# EAGLE design line_sensor_t (EAGLE 7.2.0)
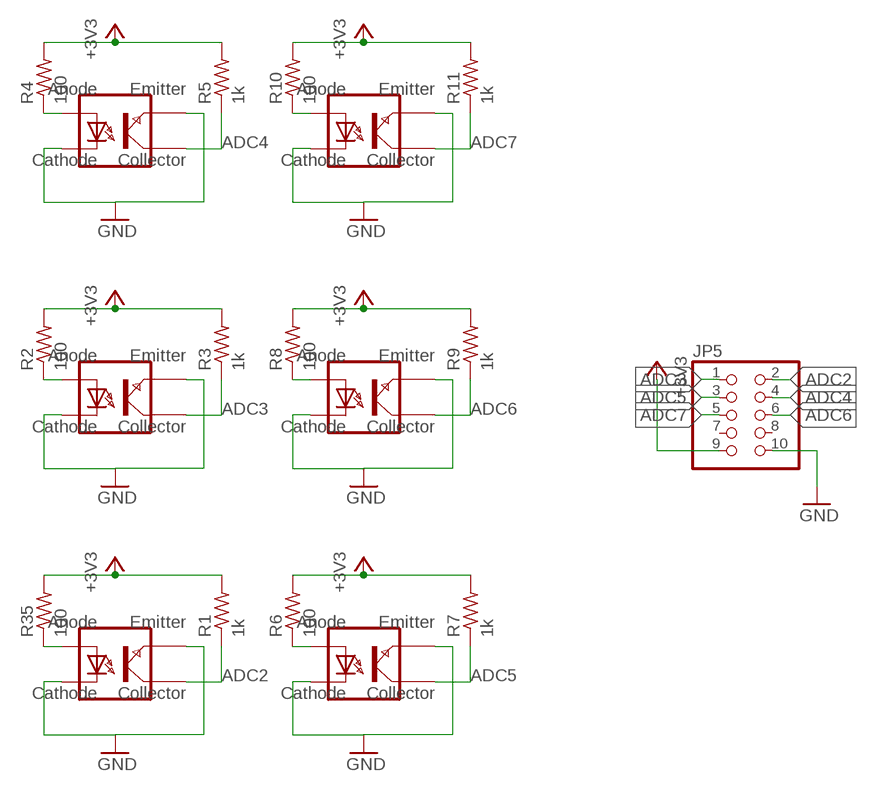
[diagram p0: schematic, sheet 1]

## Parts
JP5  PINHD-2X5/90  [2X05/90]
R1  1k  R-US_M2012  [M2012]
R2  100  R-US_M2012  [M2012]
R3  1k  R-US_M2012  [M2012]
R4  100  R-US_M2012  [M2012]
R5  1k  R-US_M2012  [M2012]
R6  100  R-US_M2012  [M2012]
R7  1k  R-US_M2012  [M2012]
R8  100  R-US_M2012  [M2012]
R9  1k  R-US_M2012  [M2012]
R10  100  R-US_M2012  [M2012]
R11  1k  R-US_M2012  [M2012]
R35  100  R-US_M2012  [M2012]
U$1  LBR-127HLD  [LBR-127HLD]
U$2  LBR-127HLD  [LBR-127HLD]
U$3  LBR-127HLD  [LBR-127HLD]
U$4  LBR-127HLD  [LBR-127HLD]
U$5  LBR-127HLD  [LBR-127HLD]
U$6  LBR-127HLD  [LBR-127HLD]

## Nets
+3V3: JP5.9 R1.2 R2.2 R3.2 R4.2 R5.2 R6.2 R7.2 R8.2 R9.2 R10.2 R11.2 R35.2
ADC2: JP5.2 R1.1 U$1.COLLECTOR
ADC3: JP5.1 R3.1 U$2.COLLECTOR
ADC4: JP5.4 R5.1 U$3.COLLECTOR
ADC5: JP5.3 R7.1 U$4.COLLECTOR
ADC6: JP5.6 R9.1 U$5.COLLECTOR
ADC7: JP5.5 R11.1 U$6.COLLECTOR
GND: JP5.10 U$1.CATHODE U$1.EMITTER U$2.CATHODE U$2.EMITTER U$3.CATHODE U$3.EMITTER U$4.CATHODE U$4.EMITTER U$5.CATHODE U$5.EMITTER U$6.CATHODE U$6.EMITTER
N$1: R35.1 U$1.ANODE
N$2: R2.1 U$2.ANODE
N$3: R4.1 U$3.ANODE
N$4: R6.1 U$4.ANODE
N$5: R8.1 U$5.ANODE
N$6: R10.1 U$6.ANODE
Unconnected: JP5.7 JP5.8

## Library data of the parts
JP5 = pinhead:PINHD-2X5: PIN HEADER
R1-R11 R35 = rcl:R-US_: RESISTOR, American symbol
U$1-U$6 = lbr-127hld:LBR-127HLD

## Board
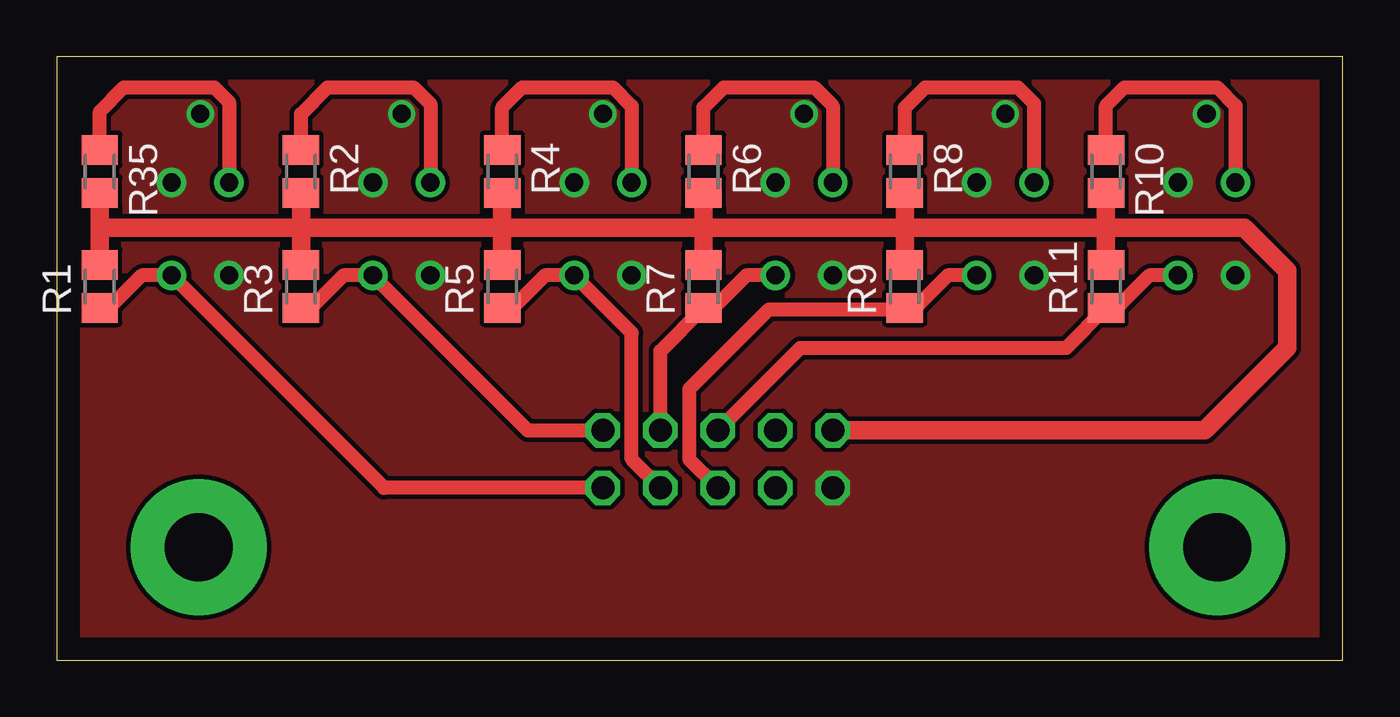
[diagram p1: board, top side]
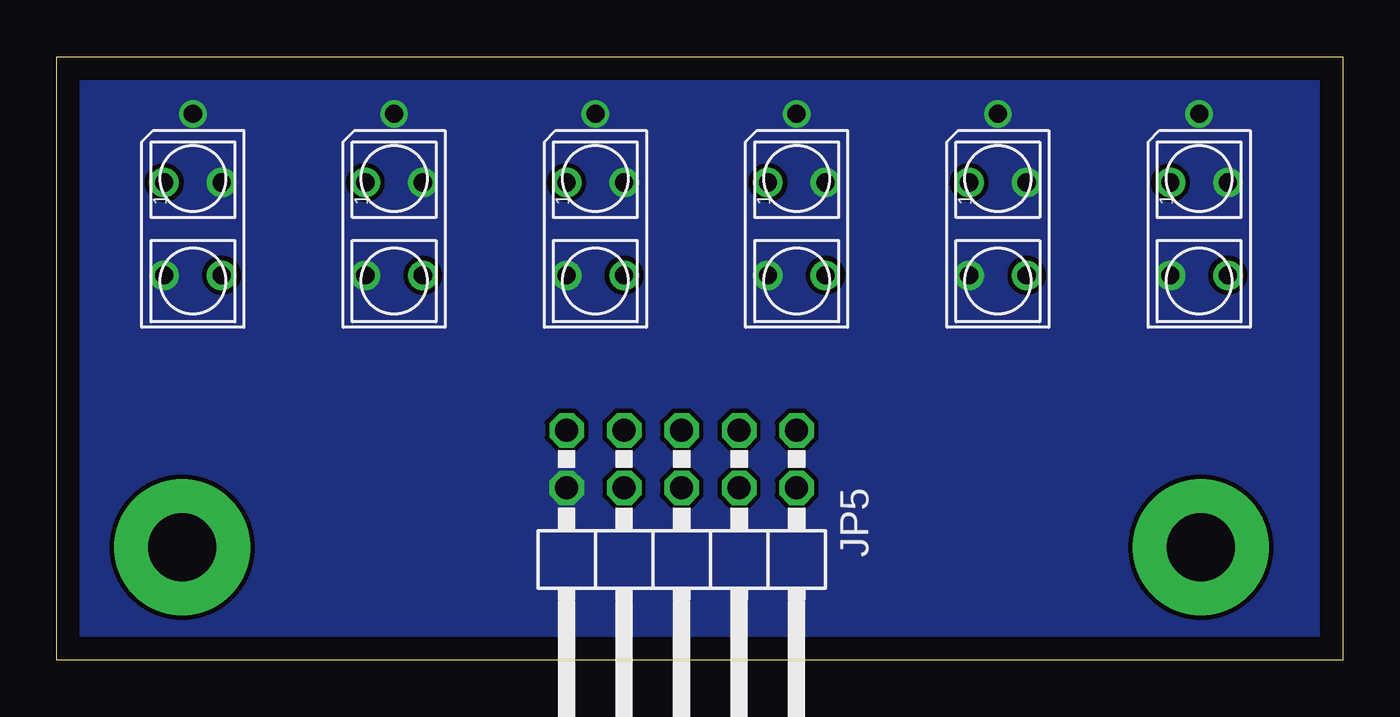
[diagram p2: board, bottom side, seen from below]

Size 56.82 x 26.66 mm. Coordinates in mm from the lower left corner, seen from the top.
Outline: 0,0 56.82,0 56.82,26.66 0,26.66 0,0
Copper layers (1*16): Top 0.035mm / dielectric 1.5mm / Bottom 0.035mm
Design rules "default": minimum track width 10mil, minimum drill 24mil, track to track 8mil, track to pad 8mil, pad to pad 8mil, via to via 8mil, smd to smd 8mil, copper to edge 40mil, drill to drill 8mil, minimum pad ring 10mil, minimum via ring 8mil, stop-mask expansion 4mil, vias tented up to drill 0mil, thermal gap 10mil

### Footprints (pad centres in the part's own frame; a part is rotated, then mirrored left to right if it is on the bottom)
2X05/90 = drill 1.016 octagon: 1 -5.08,-6.35; 2 -5.08,-3.81; 3 -2.54,-6.35; 4 -2.54,-3.81; 5 0,-6.35; 6 0,-3.81; 7 2.54,-6.35; 8 2.54,-3.81; 9 5.08,-6.35; 10 5.08,-3.81
M2012 = smd 1.3 x 1.6: 1 -0.95,0; 2 0.95,0
LBR-127HLD = drill 0.8: ANODE 2.05,1.27; CATHODE 2.05,-1.27; COLLECTOR -2.05,-1.27; EMITTER -2.05,1.27

### Placement (x,y rotation side)
JP5  29.21,3.81 180 bottom
R1  1.91,16.51 90 top
R2  10.79,21.59 270 top
R3  10.79,16.51 90 top
R4  19.68,21.59 270 top
R5  19.68,16.51 90 top
R6  28.57,21.59 270 top
R7  28.57,16.51 90 top
R8  37.47,21.59 270 top
R9  37.47,16.51 90 top
R10  46.36,21.59 270 top
R11  46.36,16.51 90 top
R35  1.91,21.59 270 top
U$1  6.35,19.05 90 bottom
U$2  15.24,19.05 90 bottom
U$3  24.13,19.05 90 bottom
U$4  33.02,19.05 90 bottom
U$5  41.91,19.05 90 bottom
U$6  50.8,19.05 90 bottom

### Tracks (layer width: path | path; a pad name or v marks a point on that pad's centre or on a via)
+3V3
  Top 0.813: JP5.9 50.73,10.16 54.37,13.8 54.37,17.2 52.47,19.1 46.57,19.1 | 46.57,19.1 46.17,19.1 | 46.17,19.1 37.67,19.1 | 37.67,19.1 37.27,19.1 | 37.27,19.1 28.77,19.1 | 28.77,19.1 19.67,19.1 | 19.67,19.1 10.87,19.1 | 10.87,19.1 10.67,19.1 | 10.67,19.1 2,19.1 1.91,19 | R35.2 1.91,19 | 1.91,19 R1.2 | R2.2 10.79,19.23 10.67,19.1 | R3.2 10.79,19.02 10.87,19.1 | R4.2 19.68,19.11 19.67,19.1 | R5.2 19.68,19.09 19.67,19.1 | R6.2 28.57,19.3 28.77,19.1 | R7.2 28.57,18.91 28.77,19.1 | R8.2 37.47,19.3 37.27,19.1 | R9.2 37.47,18.89 37.67,19.1 | R10.2 46.36,19.29 46.17,19.1 | R11.2 46.36,18.89 46.57,19.1
ADC2
  Top 0.61: JP5.2 14.46,7.62 U$1.COLLECTOR 3.77,17 2.33,15.56 R1.1
ADC3
  Top 0.61: JP5.1 20.81,10.16 U$2.COLLECTOR 12.67,17 11.37,15.7 10.93,15.7 R3.1
ADC4
  Top 0.61: JP5.4 25.4,8.89 25.4,14.46 U$3.COLLECTOR 21.57,17 20.27,15.7 19.82,15.7 R5.1
ADC5
  Top 0.61: U$4.COLLECTOR 30.47,17 29.27,15.8 28.82,15.8 R7.1 26.67,13.65 JP5.3
ADC6
  Top 0.61: JP5.6 27.94,8.89 27.94,11.97 31.47,15.5 37.41,15.5 R9.1 37.61,15.7 38.07,15.7 39.37,17 U$5.COLLECTOR
ADC7
  Top 0.61: JP5.5 32.85,13.8 44.6,13.8 R11.1 46.5,15.7 46.97,15.7 48.27,17 U$6.COLLECTOR
GND  (via drill 0.8)
  other vias: 6.35,24.13 15.24,24.13 24.13,24.13 33.02,24.13 41.91,24.13 50.8,24.13
  pour Top (rank 6, no thermals): -3.81,33.02 66.04,33.02 66.04,-5.08 -3.81,-5.08
  pour Bottom (rank 6, no thermals): -2.54,31.75 62.23,31.75 62.23,-3.81 -2.54,-3.81
N$1
  Top 0.61: R35.1 1.91,24.23 2.97,25.3 6.97,25.3 7.62,24.65 U$1.ANODE
N$2
  Top 0.61: R2.1 10.79,24.12 11.97,25.3 15.77,25.3 16.51,24.56 U$2.ANODE
N$3
  Top 0.61: R4.1 19.68,24.41 20.57,25.3 24.57,25.3 25.4,24.47 U$3.ANODE
N$4
  Top 0.61: R6.1 28.57,24.41 29.47,25.3 33.47,25.3 34.29,24.48 U$4.ANODE
N$5
  Top 0.61: R8.1 37.47,24.39 38.37,25.3 42.47,25.3 43.18,24.59 U$5.ANODE
N$6
  Top 0.61: R10.1 46.36,24.48 47.17,25.3 51.27,25.3 52.07,24.5 U$6.ANODE
N$7  (via drill 3 pad 6)
  other vias: 6.27,5
N$8  (via drill 3 pad 6)
  other vias: 51.27,5